# EAGLE schematic bjt-cc (EAGLE 9.6.1)
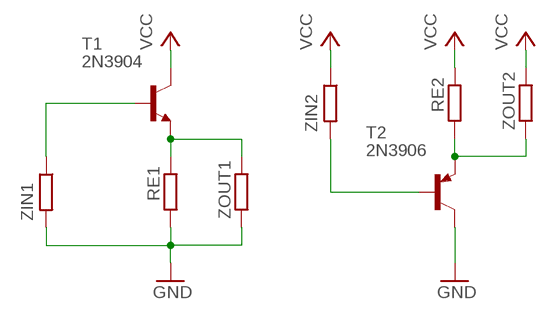
[diagram p0: schematic, sheet 1]

## Parts
RE1  R-EU_0207/10  [0207/10]
RE2  R-EU_0207/10  [0207/10]
T1  2N3904  [TO92]
T2  2N3906  [TO92]
ZIN1  R-EU_0207/10  [0207/10]
ZIN2  R-EU_0207/10  [0207/10]
ZOUT1  R-EU_0207/10  [0207/10]
ZOUT2  R-EU_0207/10  [0207/10]

## Nets
GND: RE1.1 T2.1(C) ZIN1.2 ZOUT1.1
N$1: T1.2(B) ZIN1.1
N$2: RE1.2 T1.3(E) ZOUT1.2
N$3: T2.2(B) ZIN2.2
N$4: RE2.1 T2.3(E) ZOUT2.1
VCC: RE2.2 T1.1(C) ZIN2.1 ZOUT2.2

## Library data of the parts
RE1 RE2 ZIN1 ZIN2 ZOUT1 ZOUT2 = rcl:R-EU_: RESISTOR, European symbol; SPICEPREFIX: R
T1 = transistor:2N3904: NPN TRANSISTOR
T2 = transistor-pnp:2N3906: PNP Transistor